# Altium schematic sheet main.SchDoc
size A4
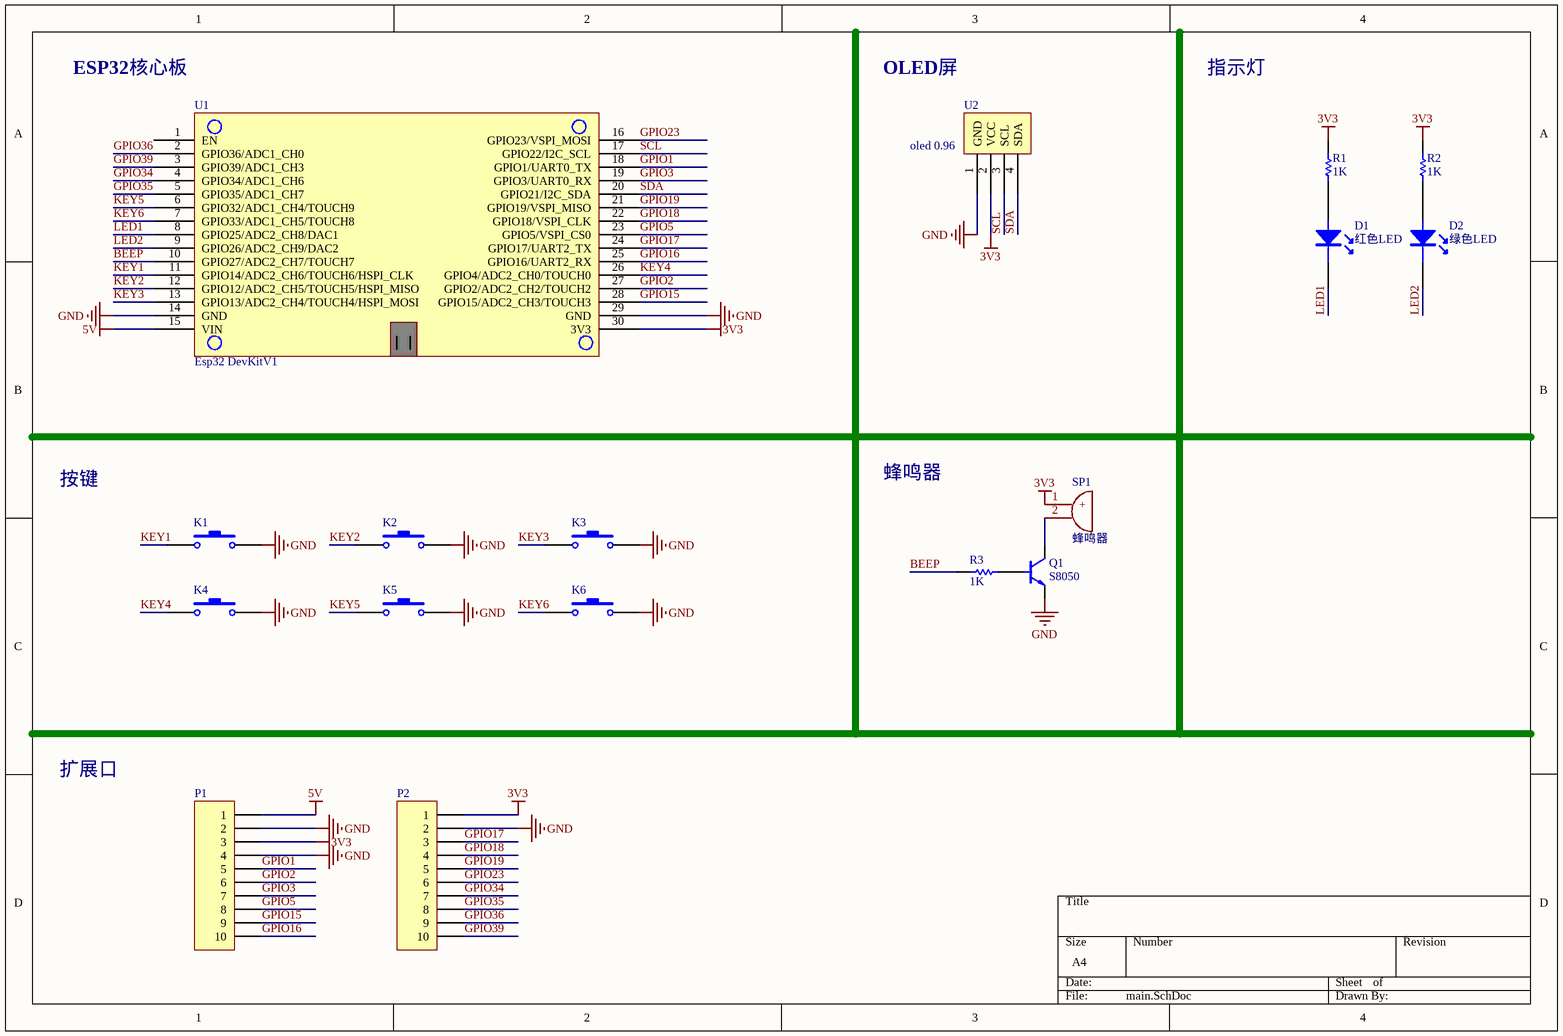
[diagram p0: main.SchDoc]

## Parts
D1  红色LED  [LED_3mm]
D2  绿色LED  [LED_3mm]
K1  KEY_12x12x7.3  [KEY-12x12]  (value not drawn)
K2  KEY_12x12x7.3  [KEY-12x12]  (value not drawn)
K3  KEY_12x12x7.3  [KEY-12x12]  (value not drawn)
K4  KEY_12x12x7.3  [KEY-12x12]  (value not drawn)
K5  KEY_12x12x7.3  [KEY-12x12]  (value not drawn)
K6  KEY_12x12x7.3  [KEY-12x12]  (value not drawn)
P1  Header10  [HDR1X10_2.54]  (value not drawn)
P2  Header10  [HDR1X10_2.54]  (value not drawn)
Q1  S8050  [TO-226-AA]
R1  1K  [AXIAL-0.3]
R2  1K  [AXIAL-0.3]
R3  1K  [AXIAL-0.3]
SP1  蜂鸣器  [BUZZER-12095-3V]
U1  Esp32 DevKitV1  [Esp32DevKitV1]
U2  oled 0.96  [oled0.96i2c]

## Nets
3V3: P1.3 P2.1 R1.2 R2.2 SP1.1(+) U1.30(3V3) U2.2(VCC)
5V: P1.1 U1.15(VIN)
GND: K1.2 K2.2 K3.2 K4.2 K5.2 K6.2 P1.2 P1.4 P2.2 Q1.1(E) U1.14(GND) U1.29(GND) U2.1(GND)
BEEP: R3.2 U1.10(GPIO27/ADC2_CH7/TOUCH7)
GPIO1: P1.5 U1.18(GPIO1/UART0_TX)
GPIO2: P1.6 U1.27(GPIO2/ADC2_CH2/TOUCH2)
GPIO3: P1.7 U1.19(GPIO3/UART0_RX)
GPIO5: P1.8 U1.23(GPIO5/VSPI_CS0)
GPIO15: P1.9 U1.28(GPIO15/ADC2_CH3/TOUCH3)
GPIO16: P1.10 U1.25(GPIO16/UART2_RX)
GPIO17: P2.3 U1.24(GPIO17/UART2_TX)
GPIO18: P2.4 U1.22(GPIO18/VSPI_CLK)
GPIO19: P2.5 U1.21(GPIO19/VSPI_MISO)
GPIO23: P2.6 U1.16(GPIO23/VSPI_MOSI)
GPIO34: P2.7 U1.4(GPIO34/ADC1_CH6)
GPIO35: P2.8 U1.5(GPIO35/ADC1_CH7)
GPIO36: P2.9 U1.2(GPIO36/ADC1_CH0)
GPIO39: P2.10 U1.3(GPIO39/ADC1_CH3)
KEY1: K1.1 U1.11(GPIO14/ADC2_CH6/TOUCH6/HSPI_CLK)
KEY2: K2.1 U1.12(GPIO12/ADC2_CH5/TOUCH5/HSPI_MISO)
KEY3: K3.1 U1.13(GPIO13/ADC2_CH4/TOUCH4/HSPI_MOSI)
KEY4: K4.1 U1.26(GPIO4/ADC2_CH0/TOUCH0)
KEY5: K5.1 U1.6(GPIO32/ADC1_CH4/TOUCH9)
KEY6: K6.1 U1.7(GPIO33/ADC1_CH5/TOUCH8)
LED1: D1.2 U1.8(GPIO25/ADC2_CH8/DAC1)
LED2: D2.2 U1.9(GPIO26/ADC2_CH9/DAC2)
SCL: U1.17(GPIO22/I2C_SCL) U2.3(SCL)
SDA: U1.20(GPIO21/I2C_SDA) U2.4(SDA)
NetD1_1: D1.1 R1.1
NetD2_1: D2.1 R2.1
NetQ1_2: Q1.2(B) R3.1
NetQ1_3: Q1.3(C) SP1.2(-)

Not connected (* = marked no-connect by the designer): U1 1(EN)

## Notes on the sheet
- ESP32核心板
- OLED屏
- 指示灯
- 按键
- 蜂鸣器
- 扩展口

## Library data of the parts
D1 D2 = LED
K1-K6 = KEY_12x12x7.3: 品牌: 佳信微数码专营店; 型号: key12x12x7.3
R1-R3 = 电阻
SP1 = BUZZER-12095-3V: 品牌: 佳信微数码; 型号: 12095-3V
U1 = Esp32DevKitV1: 品牌: 优信电子; 型号: Esp32DevKitV1
U2 = oled0.96i2c: 品牌: 中景园电子; 型号: 0.96寸i2c接口